# Altium schematic sheet Battery Pack BP8.SchDoc: BP7-BP8-BP9 Battery Pack TI
size A4; Author: NJV; Organization: Verduin Engineering; Address1: Zuilenburg 67; Address2: 1965 NW  Heemskerk; Address3: Nederland; Address4: http://www.verelec.nl; DocumentNumber: 20231020001; Revision: 1.3; SheetNumber: 1; SheetTotal: 1; Rule: PcbType=ProtelPcb
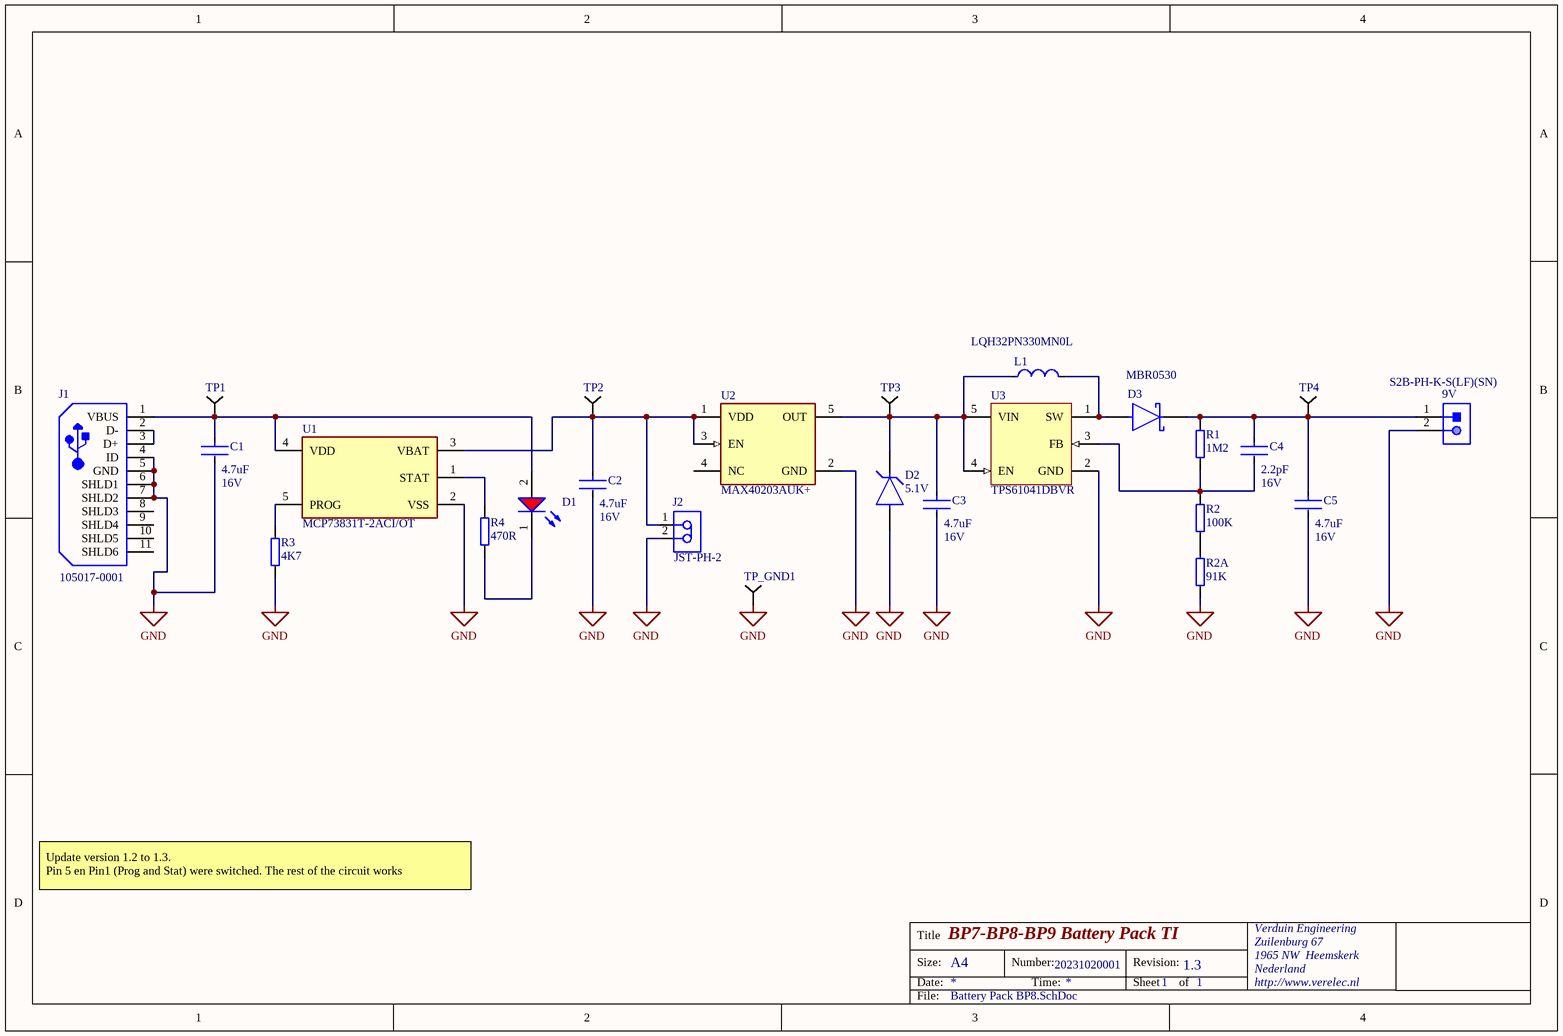
[diagram p0: Battery Pack BP8.SchDoc]

## Parts
9V  S2B-PH-K-S(LF)(SN)  [JST-S2B-PH-K-S_V]
C1  Voltage Rating: 16V  Capacitance: 4.7uF  [FP-0805-L_2_01_0_2-W_1_25-MFG]  (hidden comment: GCM21BR71C475KA73K)
C2  Voltage Rating: 16V  Capacitance: 4.7uF  [FP-0805-L_2_01_0_2-W_1_25-MFG]  (hidden comment: GCM21BR71C475KA73K)
C3  Voltage Rating: 16V  Capacitance: 4.7uF  [FP-0805-L_2_01_0_2-W_1_25-MFG]  (hidden comment: GCM21BR71C475KA73K)
C4  Voltage Rating: 16V  Capacitance: 2.2pF  [FP-0805-L_2_01_0_2-W_1_25-MFG]  (hidden comment: C0805C229C2GACTU)
C5  Voltage Rating: 16V  Capacitance: 4.7uF  [FP-0805-L_2_01_0_2-W_1_25-MFG]  (hidden comment: GCM21BR71C475KA73K)
D1  150080RS75000  [WL-SMCW_0805_150080xx75000]  (value not drawn)
D2  Nom Zener Voltage: 5.1V  [FP-SOD123-MFG]  (hidden comment: BZT52C5V1-7-F)
D3  MBR0530  [FP-425-04-MFG]
J1  105017-0001  [USB-MICRO-B_V]
J2  value JST-PH-2  [JST-B2B-PH-K-S_V]  (hidden comment: B2BPHKSLFSN)
L1  LQH32PN330MN0L  [FP-LQH32PB_N0-MFG]
R1  value 1M2  [RES0805]  (hidden comment: RES)
R2  value 100K  [RES0805]  (hidden comment: RES)
R2A  value 91K  [RES0805]  (hidden comment: RES)
R3  value 4K7  [RES0805]  (hidden comment: RES)
R4  value 470R  [RES0805]  (hidden comment: RES)
TP1  TESTPOINT  [TP-TOP]  (value not drawn)
TP2  TESTPOINT  [TP-TOP]  (value not drawn)
TP3  TESTPOINT  [TP-TOP]  (value not drawn)
TP4  TESTPOINT  [TP-TOP]  (value not drawn)
TP_GND1  TESTPOINT  [TP-TOP]  (value not drawn)
U1  MCP73831T-2ACI/OT  [SOT23-5]
U2  MAX40203AUK+  [FP-U5-2-MFG]
U3  TPS61041DBVR  [DBV0005A_M]

## Nets
GND: 9V.2 C1.2 C2.2 C3.2 C5.2 D2.2(A) J1.4(ID) J1.5(GND) J1.6(SHLD1) J1.7(SHLD2) J2.2 R2A.1 R3.1 TP_GND1.0 U1.2(VSS) U2.2(GND) U3.2(GND)
Net9V_1: 9V.1 C4.1 C5.1 D3.1(C) R1.2 TP4.0
NetC1_1: C1.1 D1.2(A) J1.1(VBUS) TP1.0 U1.4(VDD)
NetC2_1: C2.1 J2.1 TP2.0 U1.3(VBAT) U2.1(VDD) U2.3(EN)
NetC3_1: C3.1 D2.1(C) L1.1 TP3.0 U2.5(OUT) U3.4(EN) U3.5(VIN)
NetC4_2: C4.2 R1.1 R2.2 U3.3(FB)
NetD1_1: D1.1(K) R4.1
NetD3_2: D3.2(A) L1.2 U3.1(SW)
NetJ1_2: J1.2(D-) J1.3(D+)
NetR2_1: R2.1 R2A.2
NetR3_2: R3.2 U1.5(PROG)
NetR4_2: R4.2 U1.1(STAT)

Not connected (* = marked no-connect by the designer): J1 8(SHLD3) 9(SHLD4) 10(SHLD5) 11(SHLD6); U2 4(NC)

## Notes on the sheet
- Update version 1.2 to 1.3.
  Pin 5 en Pin1 (Prog and Stat) were switched. The rest of the circuit works
- Title
- Size:
- Date:
- A4
- Number:
- Time:
- Revision:
- Sheet
- of
- File:

## Library data of the parts
9V = CMP-1755-00004-1: Male Header, Pitch 2 mm, 1 x 2 Position, Height 4.8 mm, Tail Length 3.4 mm, -25 to 85 degC, RoHS, Bulk; Case\Package: Radial; Tolerance: 20%; Capacitance: 10 uF; Voltage Rating (DC): 50 V; Packaging: Bulk; ComponentLink1URL: http://www.jst-mfg.com/product/pdf/eng/ePH.pdf; Radiation Hardening: No; Height: 11 mm; Package Quantity: 200; PackageDescription: Male Header, Pitch 2 mm, 1 x 2 Position, Height 4.8 mm, Tail Length 3.4 mm; PackageReference: S2B-PH-K-S; Diameter: 5 mm; Pins: 2; Mount: Through Hole; Max Operating Temperature: 85 degC; Min Operating Temperature: -40 degC; ComponentLink1Description: Datasheet; DatasheetVersion: Dec-12; Length: 11 mm; Lead Pitch: 2 mm; REACH SVHC: No SVHC; Voltage Rating: 50 V; RoHSCompliant: true
C1-C3 C5 = CMP-2007-04518-2: General Purpose Ceramic Capacitor, 0805, 4.7uF, 10%, X7R, 15%, 16V; Dissipation Factor: 3.5%; Voltage: 10V; Height: 1.52mm; Package Quantity: 1; RoHS Compliant: Yes; Mount: Surface Mount; REACH SVHC: No SVHC; Number of Pins: 2; Packaging: Tape and Reel; Radiation Hardening: No; Thickness: 0.06inch; Width: 0.049inch; Length: 2.01mm; Termination: SMD/SMT; Case Code (Metric): 2012; Max Operating Temperature: 125°C; Construction: Flat; Series: -; Depth: 1.25mm; Voltage Rating (DC): 16V; Dielectric: X7R; Contact Plating: Tin; Tolerance: 10%; Lead Free: Lead Free; Min Operating Temperature: -55°C; Case Code (Imperial): 0805; Case/Package: 0805; Value: 4.7uF
C4 = CMP-2007-04518-2: General Purpose Ceramic Capacitor, 0805, 4.7uF, 10%, X7R, 15%, 16V; Dissipation Factor: 3.5%; Voltage: 10V; Value: 2.2pF; Height: 1.52mm; Package Quantity: 1; RoHS Compliant: Yes; Mount: Surface Mount; REACH SVHC: No SVHC; Number of Pins: 2; Packaging: Tape and Reel; Radiation Hardening: No; Thickness: 0.06inch; Width: 0.049inch; Length: 2.01mm; Termination: SMD/SMT; Case Code (Metric): 2012; Max Operating Temperature: 125°C; Construction: Flat; Series: -; Depth: 1.25mm; Voltage Rating (DC): 16V; Dielectric: X7R; Contact Plating: Tin; Tolerance: 10%; Lead Free: Lead Free; Min Operating Temperature: -55°C; Case Code (Imperial): 0805; Case/Package: 0805
D1 = CMP-1426-00011-2: NexarPartId: 29717781; Peak Wavelength: 630nm; Wavelength: 625nm; Viewing Angle: 140°; Test Current: 20mA; Forward Voltage: 2V; Forward Current: 100mA; Lens Style: Clear, Rectangular; Color: Red; Luminous Intensity: 150mcd; Max Reverse Voltage (DC): 5V; Length: 2mm; Case Code (Imperial): 0805; RoHS: Compliant; Max Operating Temperature: 85°C; Height: 700µm; Packaging: Tape and Reel; Case/Package: 0805; REACH SVHC: Unknown; Dominant Wavelength: 625nm; Min Operating Temperature: -40°C; Case Code (Metric): 2012; Mount: Surface Mount; Width: 1.25mm
D2 = CMP-2000-05976-2: DIODE ZENER 5.1V 500MW SOD123; Manufacturer: Diodes Incorporated; Standoff Height: 0mm; Max Reverse Leakage Current: 2uA; Forward Current: 10mA; Power Dissipation: 370mW; Max Zener Voltage: 5.4V; Zener Impedance: 60Ω; Automotive Grade: NA; Max Junction Temp: +150°C; Device Class L3: Zener Diodes; ComponentLink2Description: Datasheet; Manufacturer Part Number: BZT52C5V1-7-F; Mouser Description: Zener Diodes 5.1V 500mW; Octopart: https://octopart.com/bzt52c5v1-7-f-diodes+inc.-326718; Package: SOD123; RoHS: TRUE; Device Class L1: Discrete Semiconductors; Lead Free: Yes; Footprint Url: https://www.diodes.com/assets/Package-Files/SOD123.pdf; ComponentLink2URL: https://www.diodes.com/assets/Datasheets/ds18004.pdf; Digikey Description: DIODE ZENER 5.1V 500MW SOD123; Height: 1.45mm; Temperature Range Low: -65°C; Device Class L2: Diodes; Temperature: -65°C to +150°C; Automotive: No; Temperature Range High: +150°C; Category: Diode
D3 = CMP-2000-05113-2: DIODE SCHOTTKY 30V 500MA SOD123; Polarity: Standard; Max Reverse Leakage Current: 130uA; Forward Voltage: 430mV; Element Configuration: Single; Peak Non-Repetitive Surge Current: 5.5A; REACH SVHC: No SVHC; Contact Plating: Tin; Width: 1.6mm; Weight: 0.03g; Max Reverse Voltage (DC): 30V; Mount: Surface Mount; Max Repetitive Reverse Voltage (Vrrm): 30V; Number of Pins: 2; Height: 1.03mm; Current Rating: 500mA; Max Forward Surge Current (Ifsm): 5.5A; Lead Free: Lead Free; Max Surge Current: 5.5A; Peak Reverse Current: 130uA; Min Operating Temperature: -65°C; Radiation Hardening: No; Max Operating Temperature: 150°C; Average Rectified Current: 500mA; Packaging: Tape and Reel; Length: 2.7mm; Forward Current: 500mA; Voltage Rating (DC): 30V; Package Quantity: 1; Output Current: 500mA
J1 = CMP-2000-05827-1: Micro-USB B Receptacle, Right Angle, Bottom Mount, Surface Mount, with Solder Tabs, -30 to 85 degC, 5-Pin USB, RoHS, Tape and Reel; Manufacturer: Molex; Featured Product: Micro-USBConnectorsUSBConnectors; Other Names: WM1399DKR; Package Version: Rev. F, 12/2012; Number of Contacts: 5; Connector Type: USB-microB; Catalog Drawings: 1050170001; 3D Model: 105017-0001.stp; Mating Products: WM17145-ND-CABLEMICROUSBBTOSTDA1.0MWM17147-ND-CABLEMICROUSBBTOSTDA2.0MWM17146-ND-CABLEMICROUSBBTOSTDA1.5M; PCN Assembly/Origin: ResinSupplier21/Oct/2015; Voltage - Max: 30V; Online Catalog: Molex-MicroUSB; Manufacturer URL: http://www.molex.com/; Package Description: 5-Leads USB, Micro B, Body 7.5 x 5 mm, Pitch 0.65 mm; Datasheet URL: http://www.molex.com/elqNow/elqRedir.htm?ref=http://www.molex.com/webdocs/datasheets/pdf/en-us/1050170001_IO_CONNECTORS.pdf; Ingress Protection: -; Datasheet Version: 03/2016; Mounting Type: BoardCutout,SurfaceMount,RightAngle; Circuits: 5; Standard Package: 1; Package Reference: MICRO-B; Package URL: http://www.molex.com/pdm_docs/sd/1050170001_sd.pdf; Category: Connectors,Interconnects; Series: -; RoHS Information: 1050170001CertofCompliance; Features: Shielded,SolderRetention; Family: USB,DVI,HDMIConnectors; Specifications: -; Gender: Receptacle; Packaging: Digi-Reel®; Mounting Technology: SurfaceMount
J2 = CMP-002-00127-1: Connector Header, PH Series, 2 Position, 2.00mm, Through Hole, Press-Fit, Solder, Natural
L1 = CMP-06042-000935-1: Wire Wound Ferrite Inductor for Power Lines 33μH ±20% 1.38Ω 390mA 1210; Self Resonant Frequency: 13MHz; Max DC Current: 380mA; Inductance: 33uH; Test Frequency: 1MHz; Shielding: Shielded; DC Resistance (DCR): 1.38R; Resistor Type: Wirewound; Max Operating Temperature: 85°C; Case Code (Imperial): 1210; Depth: 2.5mm; Height: 2mm; Case Code (Metric): 3225; Width: 0.098inch; Mount: Surface Mount; Saturation Current: 380mA; Tolerance: 20%; Height - Seated (Max): 0.086inch; Packaging: Tape and Reel; Weight: 0.001552oz; Min Operating Temperature: -40°C; Length: 3.2mm; Termination: SMD/SMT; Current Rating: 390mA; Case/Package: 1210; Core Material: Ferrite; Package Quantity: 2000
R1 R3 R4 = RES-SM-0805-NC: RES SM 0805 NC; Manufacturer: GENERIC; Part Number: RES-SM-0805-NC; Package: 0805
R2 = RES-SM-0805-NC: RES SM 0805 NC; Part Number: CRCW0805100KFKEA; Manufacturer: Vishay; Package: 0805
R2A = RES-SM-0805-NC: RES SM 0805 NC; Part Number: CRCW080591K0FKEA; Manufacturer: GENERIC; Package: 0805
TP1-TP4 TP_GND1 = CMP-029-000000-1: Part Number: TESTPOINT
U1 = CMP-031-00106-1: Power Supply Support Circuit, Adjustable, 1 Channel, PDSO5; Max Supply Voltage: 6V; Min Supply Voltage: 3.75V; RoHS Compliant: Yes; Max Operating Temperature: 85°C; Pins: 5; Case/Package: LSSOP; Min Operating Temperature: -40°C
U2 = CMP-05723-000008-1: IC IDEAL DIODE; Manufacturer: Maxim Integrated; Output Current: 2A; Number Of Outputs: 1; Min Supply Voltage: 1.2V; Nominal Supply Current: 0.13-0.3uA; Max Power Dissipation: 312.6mW; Standoff Height: 0mm; Max Junction Temp: +150°C; Max Supply Voltage: 5.5V; Device Class L2: Power Management ICs; Temperature Range High: +125°C; Automotive: No; Number Of Rails Monitored: 1; Ipc Land Pattern Name: SOT95P280X125-5; ComponentLink2Description: Datasheet; Digikey Description: IC IDEAL DIODE; Package: U5-2; Octopart: https://octopart.com/max40203auk%2B-maxim+integrated-97007183; Device Class L1: Integrated Circuits (ICs); Footprint Url: https://pdfserv.maximintegrated.com/land_patterns/90-0174.PDF; Device Class L3: Voltage Supervisors; Temperature Range Low: -40°C; Temperature: -40°C to +125°C; RoHS: TRUE; Lead Free: Yes; ComponentLink2URL: https://datasheets.maximintegrated.com/en/ds/MAX40203.pdf; Category: IC; Manufacturer Part Number: MAX40203AUK+; Height: 1.45mm
U3 = CMP-0388-00116-2: 28 V, 250 mA Switch Boost Converter for LCD and White LED Applications, 1.8 to 6 V, -40 to 85 degC, 5-pin SOT23 (DBV5), Green (RoHS & no Sb/Br); Manufacturer: Texas Instruments; SubFamily: White LED Driver; Vin(Max)(V): 6; Rating: Catalog; Switching Frequency(Max)(kHz): 1000; Dimming: TRUE; Iq(Typ)(mA): 0.028; Vin(Min)(V): 1.8; Iout(Max)(A): 0.05; PackageVersion: 4073253-4/K; PackageDescription: 5-Pin Plastic Small Outline, Body 1.60 Ãƒâ€” 2.90 mm, Pitch 0.95 mm; Mounting Technology: Surface Mount; Topology: Boost; ComponentLink2Description: Datasheet; DatasheetVersion: SLVS413F; ComponentLink3URL: http://www.ti.com/litv/pdf/mpds018i; ComponentLink3Description: Package Specification; Code_JEDEC: MO-178; Eco-Plan: Green (RoHS & no Sb/Br); ComponentLink1URL: http://www.ti.com/; ComponentLink2URL: http://www.ti.com/general/docs/lit/getliterature.tsp?genericPartNumber=TPS61041&fileType=pdf; PackageReference: DBV0005A; PartNumber: TPS61041DBVR; ComponentLink1Description: Manufacturer URL